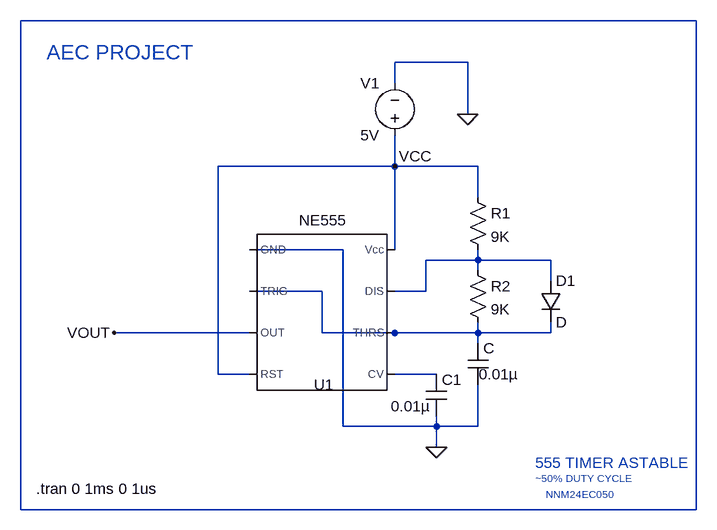
[diagram p0: schematic 555.asc]
555.asc, the LTspice schematic file:
Version 4.1
SHEET 1 880 680
WIRE 816 -288 -224 -288
WIRE 464 -224 352 -224
WIRE 352 -192 352 -224
WIRE 464 -144 464 -224
WIRE 352 -64 352 -112
WIRE 352 -64 80 -64
WIRE 480 -64 352 -64
WIRE 480 -16 480 -64
WIRE 272 64 128 64
WIRE 352 64 352 -64
WIRE 480 80 480 64
WIRE 480 80 400 80
WIRE 592 80 480 80
WIRE 480 96 480 80
WIRE 592 112 592 80
WIRE 240 128 128 128
WIRE 400 128 400 80
WIRE 400 128 352 128
WIRE 128 192 -80 192
WIRE 240 192 240 128
WIRE 352 192 240 192
WIRE 480 192 480 176
WIRE 480 192 352 192
WIRE 592 192 592 176
WIRE 592 192 480 192
WIRE 480 208 480 192
WIRE 80 256 80 -64
WIRE 128 256 80 256
WIRE 416 256 352 256
WIRE 272 336 272 64
WIRE 416 336 416 320
WIRE 416 336 272 336
WIRE 480 336 480 272
WIRE 480 336 416 336
WIRE 416 368 416 336
WIRE -224 464 -224 -288
WIRE 816 464 816 -288
WIRE 816 464 -224 464
FLAG 416 368 0
FLAG -80 192 VOUT
FLAG 464 -144 0
FLAG 352 -64 VCC
SYMBOL Misc\\NE555 240 160 R0
WINDOW 0 3 112 Center 2
WINDOW 3 1 -141 Center 2
SYMATTR InstName U1
SYMBOL res 464 -32 R0
SYMATTR InstName R1
SYMATTR Value 9K
SYMBOL res 464 80 R0
SYMATTR InstName R2
SYMATTR Value 9K
SYMBOL cap 464 208 R0
WINDOW 3 17 48 Left 2
SYMATTR InstName C
SYMATTR Value 0.01µ
SYMBOL diode 576 112 R0
SYMATTR InstName D1
SYMBOL cap 400 256 R0
WINDOW 3 -54 49 Left 2
SYMATTR InstName C1
SYMATTR Value 0.01µ
SYMBOL voltage 352 -96 R180
WINDOW 0 24 96 Left 2
WINDOW 3 24 16 Left 2
WINDOW 123 0 0 Left 0
WINDOW 39 0 0 Left 0
SYMATTR InstName V1
SYMATTR Value 5V
TEXT 584 440 Left 1 ;NNM24EC050
TEXT -184 -240 Left 3 ;AEC PROJECT
TEXT 568 392 Left 2 ;555 TIMER ASTABLE
TEXT 568 416 Left 1 ;~50% DUTY CYCLE
TEXT -200 432 Left 2 !.tran 0 1ms 0 1us

The netlist it stands for:
* 555.asc
X§U1 0 N003 VOUT VCC N004 N003 N002 VCC NE555  ; pins GND TRIG OUT RST CV THRS DIS Vcc
R1 VCC N002 9K
R2 N002 N003 9K
C N003 0 0.01µ
D1 N002 N003 D
C1 N004 0 0.01µ
V1 VCC 0 5V
.model D D
.lib standard.dio
* NNM24EC050
* AEC PROJECT
* 555 TIMER ASTABLE
* ~50% DUTY CYCLE
.tran 0 1ms 0 1us
.lib NE555.sub
.backanno
.end